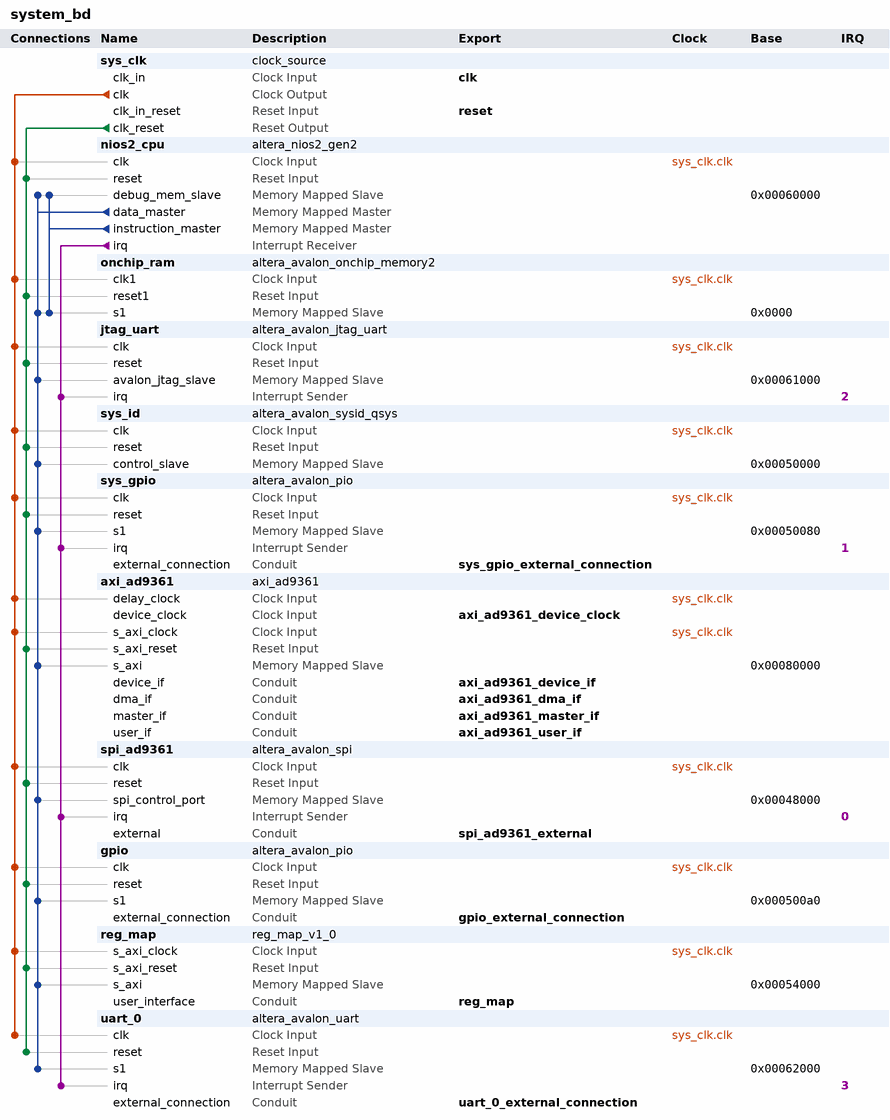
[diagram p0: system contents]
# Platform Designer (Qsys) system system_bd, Cyclone V 5CEFA4U19C7
# Parameters at their usual value, and those the tool derives, are not listed.
package require -exact qsys 15.1
create_system system_bd
set_project_property DEVICE_FAMILY {Cyclone V}
set_project_property DEVICE 5CEFA4U19C7

add_instance sys_clk clock_source 15.1
set_instance_parameter_value sys_clk clockFrequency 50000000

add_instance nios2_cpu altera_nios2_gen2 15.1
set_instance_parameter_value nios2_cpu dcache_size 2048
set_instance_parameter_value nios2_cpu exceptionSlave onchip_ram.s1
set_instance_parameter_value nios2_cpu icache_size 4096
set_instance_parameter_value nios2_cpu impl Fast
set_instance_parameter_value nios2_cpu resetSlave onchip_ram.s1

add_instance onchip_ram altera_avalon_onchip_memory2 15.1
set_instance_parameter_value onchip_ram dataWidth 32
set_instance_parameter_value onchip_ram dualPort false
set_instance_parameter_value onchip_ram initMemContent true
set_instance_parameter_value onchip_ram initializationFileName ./software/lgdst2/mem_init/system_bd_onchip_ram.hex
set_instance_parameter_value onchip_ram memorySize 196608
set_instance_parameter_value onchip_ram useNonDefaultInitFile true

add_instance jtag_uart altera_avalon_jtag_uart 15.1
set_instance_parameter_value jtag_uart simInteractiveOptions NO_INTERACTIVE_WINDOWS

add_instance sys_id altera_avalon_sysid_qsys 15.1
set_instance_parameter_value sys_id id -1395322110

add_instance sys_gpio altera_avalon_pio 15.1
set_instance_parameter_value sys_gpio bitClearingEdgeCapReg true
set_instance_parameter_value sys_gpio captureEdge true
set_instance_parameter_value sys_gpio direction InOut
set_instance_parameter_value sys_gpio edgeType ANY
set_instance_parameter_value sys_gpio generateIRQ true
set_instance_parameter_value sys_gpio irqType EDGE
set_instance_parameter_value sys_gpio width 32

add_instance axi_ad9361 axi_ad9361 1.0
set_instance_parameter_value axi_ad9361 PCORE_DEVICE_TYPE 0
set_instance_parameter_value axi_ad9361 PCORE_ID 0

add_instance spi_ad9361 altera_avalon_spi 15.1
set_instance_parameter_value spi_ad9361 clockPhase 1
set_instance_parameter_value spi_ad9361 clockPolarity 0
set_instance_parameter_value spi_ad9361 dataWidth 8
set_instance_parameter_value spi_ad9361 masterSPI true
set_instance_parameter_value spi_ad9361 numberOfSlaves 1
set_instance_parameter_value spi_ad9361 targetClockRate 1000000

add_instance gpio altera_avalon_pio 15.1
set_instance_parameter_value gpio bitModifyingOutReg true
set_instance_parameter_value gpio direction Output
set_instance_parameter_value gpio resetValue 31
set_instance_parameter_value gpio width 5

add_instance reg_map reg_map_v1_0 1.0
set_instance_parameter_value reg_map C_S00_AXI_ADDR_WIDTH 14
set_instance_parameter_value reg_map C_S00_AXI_DATA_WIDTH 32

add_instance uart_0 altera_avalon_uart 15.1
set_instance_parameter_value uart_0 baud 115200
set_instance_parameter_value uart_0 dataBits 8
set_instance_parameter_value uart_0 fixedBaud true
set_instance_parameter_value uart_0 parity NONE
set_instance_parameter_value uart_0 stopBits 1

# connections
add_connection sys_clk.clk axi_ad9361.delay_clock clock
add_connection sys_clk.clk axi_ad9361.s_axi_clock clock
add_connection sys_clk.clk gpio.clk clock
add_connection sys_clk.clk jtag_uart.clk clock
add_connection sys_clk.clk nios2_cpu.clk clock
add_connection sys_clk.clk onchip_ram.clk1 clock
add_connection sys_clk.clk reg_map.s_axi_clock clock
add_connection sys_clk.clk spi_ad9361.clk clock
add_connection sys_clk.clk sys_gpio.clk clock
add_connection sys_clk.clk sys_id.clk clock
add_connection sys_clk.clk uart_0.clk clock
add_connection sys_clk.clk_reset axi_ad9361.s_axi_reset reset
add_connection sys_clk.clk_reset gpio.reset reset
add_connection sys_clk.clk_reset jtag_uart.reset reset
add_connection sys_clk.clk_reset nios2_cpu.reset reset
add_connection sys_clk.clk_reset onchip_ram.reset1 reset
add_connection sys_clk.clk_reset reg_map.s_axi_reset reset
add_connection sys_clk.clk_reset spi_ad9361.reset reset
add_connection sys_clk.clk_reset sys_gpio.reset reset
add_connection sys_clk.clk_reset sys_id.reset reset
add_connection sys_clk.clk_reset uart_0.reset reset
add_connection nios2_cpu.data_master axi_ad9361.s_axi avalon
set_connection_parameter_value nios2_cpu.data_master/axi_ad9361.s_axi baseAddress 0x00080000
add_connection nios2_cpu.data_master gpio.s1 avalon
set_connection_parameter_value nios2_cpu.data_master/gpio.s1 baseAddress 0x000500a0
add_connection nios2_cpu.data_master jtag_uart.avalon_jtag_slave avalon
set_connection_parameter_value nios2_cpu.data_master/jtag_uart.avalon_jtag_slave baseAddress 0x00061000
add_connection nios2_cpu.data_master nios2_cpu.debug_mem_slave avalon
set_connection_parameter_value nios2_cpu.data_master/nios2_cpu.debug_mem_slave baseAddress 0x00060000
add_connection nios2_cpu.data_master onchip_ram.s1 avalon
set_connection_parameter_value nios2_cpu.data_master/onchip_ram.s1 baseAddress 0x0000
add_connection nios2_cpu.data_master reg_map.s_axi avalon
set_connection_parameter_value nios2_cpu.data_master/reg_map.s_axi baseAddress 0x00054000
add_connection nios2_cpu.data_master spi_ad9361.spi_control_port avalon
set_connection_parameter_value nios2_cpu.data_master/spi_ad9361.spi_control_port baseAddress 0x00048000
add_connection nios2_cpu.data_master sys_gpio.s1 avalon
set_connection_parameter_value nios2_cpu.data_master/sys_gpio.s1 baseAddress 0x00050080
add_connection nios2_cpu.data_master sys_id.control_slave avalon
set_connection_parameter_value nios2_cpu.data_master/sys_id.control_slave baseAddress 0x00050000
add_connection nios2_cpu.data_master uart_0.s1 avalon
set_connection_parameter_value nios2_cpu.data_master/uart_0.s1 baseAddress 0x00062000
add_connection nios2_cpu.instruction_master nios2_cpu.debug_mem_slave avalon
set_connection_parameter_value nios2_cpu.instruction_master/nios2_cpu.debug_mem_slave baseAddress 0x00060000
add_connection nios2_cpu.instruction_master onchip_ram.s1 avalon
set_connection_parameter_value nios2_cpu.instruction_master/onchip_ram.s1 baseAddress 0x0000
add_connection nios2_cpu.irq jtag_uart.irq interrupt
set_connection_parameter_value nios2_cpu.irq/jtag_uart.irq irqNumber 2
add_connection nios2_cpu.irq spi_ad9361.irq interrupt
set_connection_parameter_value nios2_cpu.irq/spi_ad9361.irq irqNumber 0
add_connection nios2_cpu.irq sys_gpio.irq interrupt
set_connection_parameter_value nios2_cpu.irq/sys_gpio.irq irqNumber 1
add_connection nios2_cpu.irq uart_0.irq interrupt
set_connection_parameter_value nios2_cpu.irq/uart_0.irq irqNumber 3

# exported interfaces
add_interface axi_ad9361_device_clock clock sink
set_interface_property axi_ad9361_device_clock EXPORT_OF axi_ad9361.device_clock
add_interface axi_ad9361_device_if conduit end
set_interface_property axi_ad9361_device_if EXPORT_OF axi_ad9361.device_if
add_interface axi_ad9361_dma_if conduit end
set_interface_property axi_ad9361_dma_if EXPORT_OF axi_ad9361.dma_if
add_interface axi_ad9361_master_if conduit end
set_interface_property axi_ad9361_master_if EXPORT_OF axi_ad9361.master_if
add_interface axi_ad9361_user_if conduit end
set_interface_property axi_ad9361_user_if EXPORT_OF axi_ad9361.user_if
add_interface clk clock sink
set_interface_property clk EXPORT_OF sys_clk.clk_in
add_interface gpio_external_connection conduit end
set_interface_property gpio_external_connection EXPORT_OF gpio.external_connection
add_interface reg_map conduit end
set_interface_property reg_map EXPORT_OF reg_map.user_interface
add_interface reset reset sink
set_interface_property reset EXPORT_OF sys_clk.clk_in_reset
add_interface spi_ad9361_external conduit end
set_interface_property spi_ad9361_external EXPORT_OF spi_ad9361.external
add_interface sys_gpio_external_connection conduit end
set_interface_property sys_gpio_external_connection EXPORT_OF sys_gpio.external_connection
add_interface uart_0_external_connection conduit end
set_interface_property uart_0_external_connection EXPORT_OF uart_0.external_connection

set_interconnect_requirement {$system} qsys_mm.clockCrossingAdapter FIFO
set_interconnect_requirement {$system} qsys_mm.maxAdditionalLatency 2
set_interconnect_requirement {mm_interconnect_0|cmd_mux} qsys_mm.postTransform.pipelineCount 0
set_interconnect_requirement {mm_interconnect_2|cmd_mux} qsys_mm.postTransform.pipelineCount 0
set_interconnect_requirement {mm_interconnect_3|cmd_mux} qsys_mm.postTransform.pipelineCount 0
set_interconnect_requirement {mm_interconnect_3|cmd_mux_001} qsys_mm.postTransform.pipelineCount 0
set_interconnect_requirement {mm_interconnect_4|axi_dmac_dac_m_src_axi_agent.write_cp/router.sink} qsys_mm.postTransform.pipelineCount 0
set_interconnect_requirement {mm_interconnect_4|cmd_mux} qsys_mm.postTransform.pipelineCount 0
set_interconnect_requirement {mm_interconnect_4|cmd_mux_001} qsys_mm.postTransform.pipelineCount 0

save_system system_bd.qsys
